# EAGLE design RH027.1 (EAGLE 7.1.0)
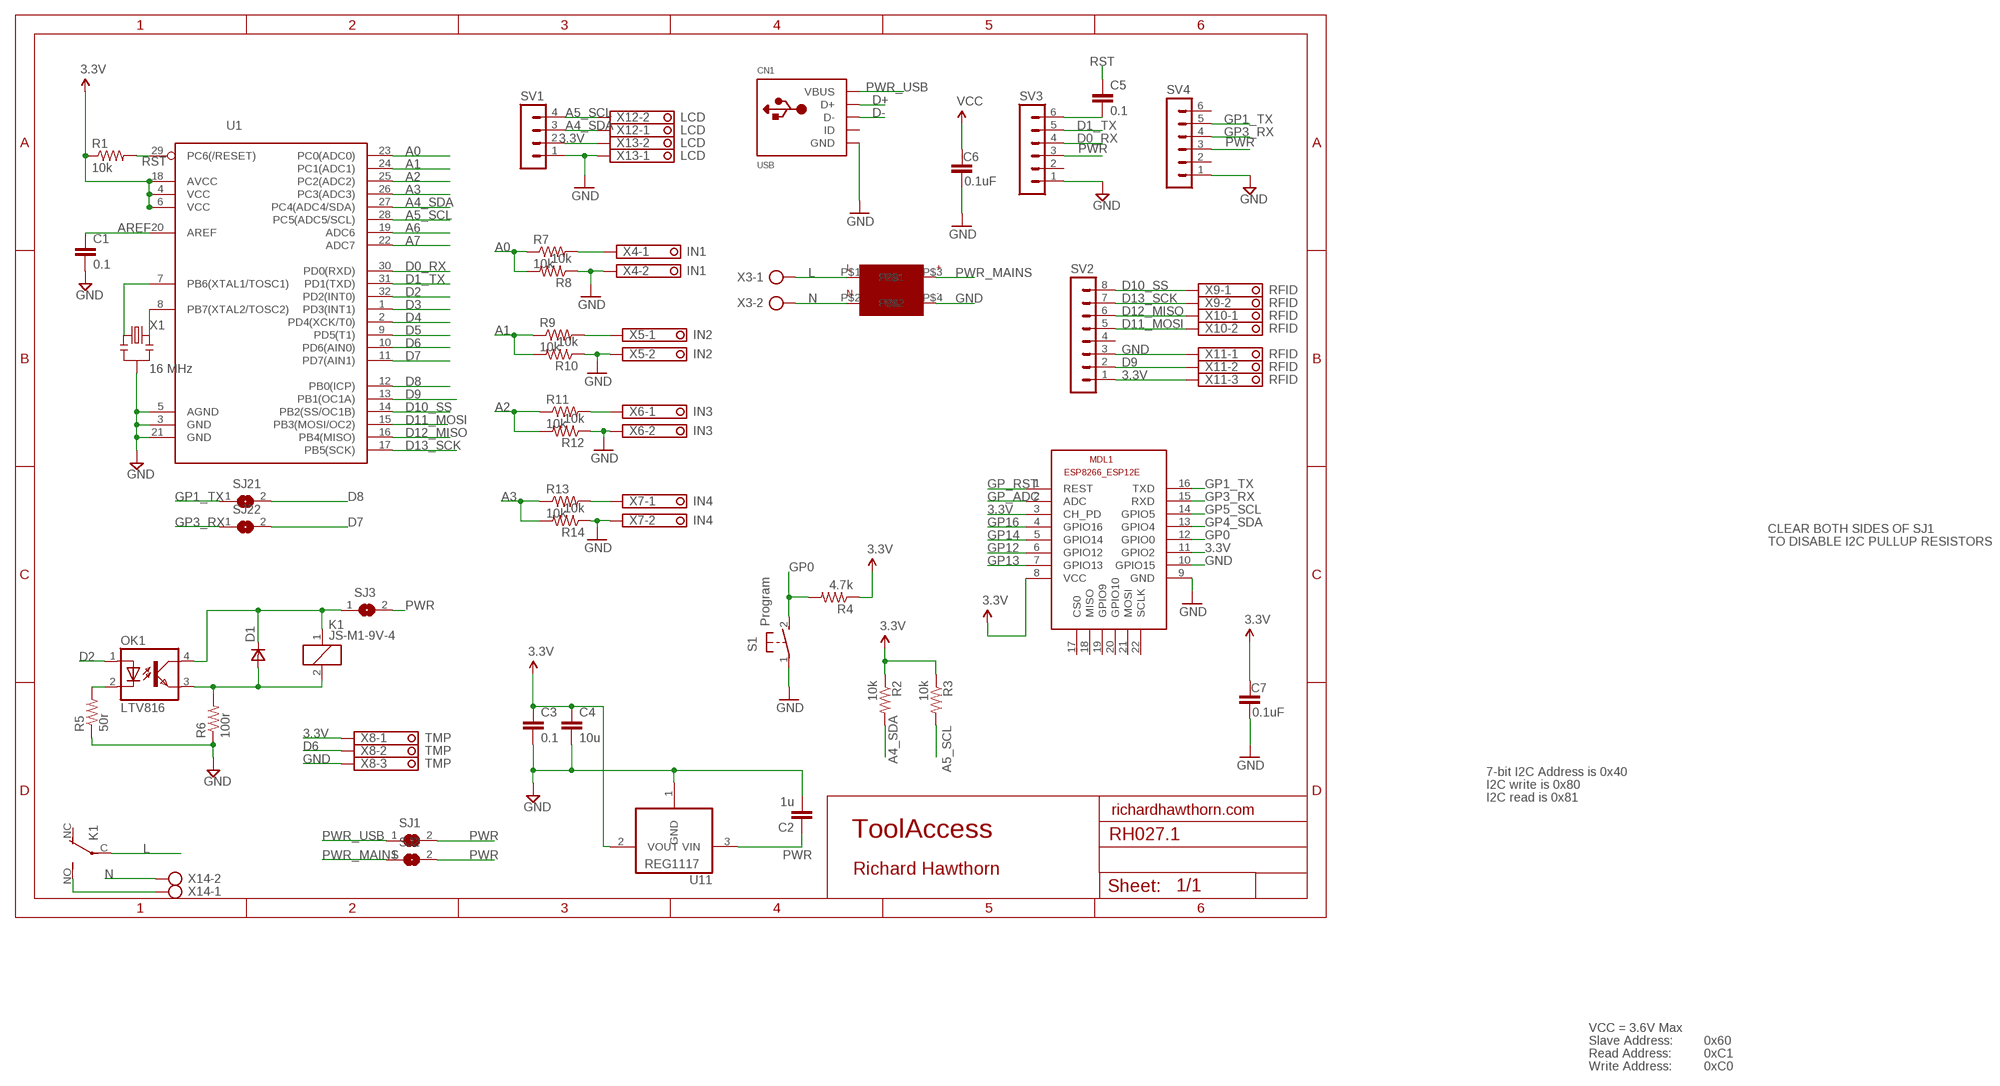
[diagram p0: schematic, sheet 1]

## Parts
C1  0.1  CAP0603-CAP  [0603-CAP]
C2  1u  CAP0603-CAP  [0603-CAP]
C3  0.1  CAP0603-CAP  [0603-CAP]
C4  10u  CAP0805-CAP  [0805-CAP]
C5  0.1  CAP0603-CAP  [0603-CAP]
C6  0.1uF  0.1UF-25V(+80/-20%)(0603)  [0603-CAP]
C7  0.1uF  0.1UF-25V(+80/-20%)(0603)  [0603-CAP]
CN1  USB  USBMINIB  [USB-MINIB]
D1  VAR2SOT23  [SOT-23]
K1  JS-M1-9V-4  [JS-M]
MDL1  ESP8266-12EESP8266-ESP12E  [ESP8266-ESP12E]
OK1  LTV816  [DIL04]
R1  10k  RESISTOR0603-RES  [0603-RES]
R2  10k  RESISTOR0805-RES  [0805]
R3  10k  RESISTOR0805-RES  [0805]
R4  4.7k  RESISTOR0805-RES  [0805]
R5  50r  RESISTOR0603-RES  [0603-RES]
R6  100r  RESISTOR0603-RES  [0603-RES]
R7  10k  RESISTOR0603-RES  [0603-RES]
R8  10k  RESISTOR0603-RES  [0603-RES]
R9  10k  RESISTOR0603-RES  [0603-RES]
R10  10k  RESISTOR0603-RES  [0603-RES]
R11  10k  RESISTOR0603-RES  [0603-RES]
R12  10k  RESISTOR0603-RES  [0603-RES]
R13  10k  RESISTOR0603-RES  [0603-RES]
R14  10k  RESISTOR0603-RES  [0603-RES]
S1  Program  DTSM-3  [DTSM-3]
SJ1  SJ  [SJ]
SJ2  SJ  [SJ]
SJ3  SJ  [SJ]
SJ21  SJ  [SJ]
SJ22  SJ  [SJ]
SV1  MA04-1  [MA04-1]
SV2  MA08-1  [MA08-1]
SV3  MA06-1  [MA06-1]
SV4  MA06-1  [MA06-1]
U1  ATMega-328  ATMEGA168/328TQFP32  [TQFP32-08]
U11  REG1117  [SOT223]
U$1  5VPWR  [5VPWR]
X1  16 MHz  RESONATORSMD  [RESONATOR-SMD]
X3  AK500/2  [AK500/2]
X4  IN1  1751248  [1751248]
X5  IN2  1751248  [1751248]
X6  IN3  1751248  [1751248]
X7  IN4  1751248  [1751248]
X8  TMP  1751251  [1751251]
X9  RFID  1751248  [1751248]
X10  RFID  1751248  [1751248]
X11  RFID  1751251  [1751251]
X12  LCD  1751248  [1751248]
X13  LCD  1751248  [1751248]
X14  AK500/2  [AK500/2]

## Nets
3.3V: C3.1 C4.1 C6.1 C7.1 MDL1.3(CH_PD) MDL1.8(VCC) MDL1.11(GPIO2) R1.1 R2.1 R3.1 R4.1 SV1.2 SV2.1 U1.4(VCC) U1.6(VCC) U1.18(AVCC) U11.2(VOUT) X8.1 X11.3 X13.2 ; supply symbol labelled VCC
A0: R7.1 R8.2 U1.23(PC0(ADC0))
A1: R9.1 R10.2 U1.24(PC1(ADC1))
A2: R11.1 R12.2 U1.25(PC2(ADC2))
A3: R13.1 R14.2 U1.26(PC3(ADC3))
A4_SDA: R2.2 SV1.3 U1.27(PC4(ADC4/SDA)) X12.1
A5_SCL: R3.2 SV1.4 U1.28(PC5(ADC5/SCL)) X12.2
A6: U1.19(ADC6)
A7: U1.22(ADC7)
AREF: C1.1 U1.20(AREF)
D0_RX: SV3.4 U1.30(PD0(RXD))
D1_TX: SV3.5 U1.31(PD1(TXD))
D2: OK1.1(A) U1.32(PD2(INT0))
D3: U1.1(PD3(INT1))
D4: U1.2(PD4(XCK/T0))
D5: U1.9(PD5(T1))
D6: U1.10(PD6(AIN0)) X8.2
D7: SJ22.2 U1.11(PD7(AIN1))
D8: SJ21.2 U1.12(PB0(ICP))
D9: SV2.2 U1.13(PB1(OC1A)) X11.2
D10_SS: SV2.8 U1.14(PB2(SS/OC1B)) X9.1
D11_MOSI: SV2.5 U1.15(PB3(MOSI/OC2)) X10.2
D12_MISO: SV2.6 U1.16(PB4(MISO)) X10.1
D13_SCK: SV2.7 U1.17(PB5(SCK)) X9.2
D+: CN1.D+
D-: CN1.D-
GND [power]: C1.2 C2.2 C3.2 C4.2 C6.2 C7.2 CN1.GND MDL1.9(GND) MDL1.10(GPIO15) R5.1 R6.1 R8.1 R10.1 R12.1 R14.1 S1.1 SV1.1 SV2.3 SV3.1 SV4.1 U1.3(GND) U1.5(AGND) U1.21(GND) U11.1(GND) U$1.P$4 X1.2 X4.2 X5.2 X6.2 X7.2 X8.3 X11.1 X13.1
GP0: MDL1.12(GPIO0) R4.2 S1.2
GP1_TX: MDL1.16(TXD) SJ21.1 SV4.5
GP3_RX: MDL1.15(RXD) SJ22.1 SV4.4
GP4_SDA: MDL1.13(GPIO4)
GP5_SCL: MDL1.14(GPIO5)
GP12: MDL1.6(GPIO12)
GP13: MDL1.7(GPIO13)
GP14: MDL1.5(GPIO14)
GP16: MDL1.4(GPIO16)
GP_ADC: MDL1.2(ADC)
GP_RST: MDL1.1(REST)
L [mains]: K1.C(2:P) U$1.P$1 X3.1
N [mains]: U$1.P$2 X3.2 X14.2
N$2: D1.3(A) K1.2 OK1.3(EMIT) R6.2
N$3: U1.7(PB6(XTAL1/TOSC1)) X1.1
N$4: OK1.2(C) R5.2
N$7 [mains]: K1.NO(2:S) X14.1
N$12: R9.2 X5.1
N$13: R7.2 X4.1
N$14: R11.2 X6.1
N$15: R13.2 X7.1
N$20: C5.2 SV3.6
N$21: U1.8(PB7(XTAL2/TOSC2)) X1.3
PWR [power]: C2.1 SJ1.2 SJ2.2 SJ3.2 SV3.3 SV4.3 U11.3(VIN)
PWR_MAINS: SJ2.1 U$1.P$3
PWR_USB [power]: CN1.VBUS SJ1.1
RL_PWR [power]: D1.1(C) K1.1 OK1.4(COL) SJ3.1
RST: C5.1 R1.2 U1.29(PC6(/RESET))
Unconnected: CN1.ID K1.NC(2:O) MDL1.17(CS0) MDL1.18(MISO) MDL1.19(GPIO9) MDL1.20(GPIO10) MDL1.21(MOSI) MDL1.22(SCLK) SV2.4 SV3.2 SV4.2 SV4.6

## Notes on the sheet
- CLEAR BOTH SIDES OF SJ1
- TO DISABLE I2C PULLUP RESISTORS
- 7-bit I2C Address is 0x40
- I2C write is 0x80
- I2C read is 0x81
- richardhawthorn.com
- ToolAccess
- Richard Hawthorn
- VCC = 3.6V Max
- Slave Address: | 0x60
- Read Address: | 0xC1
- Write Address: | 0xC0

## Library data of the parts
C1-C5 = LowPowerLab:CAP: Capacitor Standard 0603 ceramic capacitor, and 0.1" leaded capacitor.
C6 C7 = SparkFun-Capacitors:0.1UF-25V(+80/-20%)(0603): Ceramic Standard decoupling cap CAP-00810; PROD_ID: CAP-00810
CN1 = LowPowerLab:USB: USB Connectors USBMINIB - Surface Mount Female Mini-B USB Connector 4UConnector: 06564 By microbuilder.eu Thru-hole RA Female Mini-B USB Connector 4UConnector: 18732 By ladyada.net
D1 = zetex:VAR2SOT23: DIODE; OC_FARNELL: unknown; OC_NEWARK: unknown
K1 = relay:JS-M1*: Automotive Ultra-Miniature Power Relay NAiS Source: http://www.mew-europe.com/.. en_ds_61211_0000.pdf; OC_FARNELL: unknown; OC_NEWARK: unknown
MDL1 = ESP8266-ESP12E:ESP8266-12E: ESP8266-12E with additional I/O and GPIO04/05 corrected The author cannot warrant that this library is free from error or will meet your specific requirements. Created by PuceBaboon.com. Komagane, Nagano, JAPAN
OK1 = optocoupler:LTV816: OPTO COUPLER Source: LITEON, LTV816.pdf; OC_FARNELL: unknown; OC_NEWARK: unknown
R1 R5-R14 = LowPowerLab:RESISTOR: Resistor Basic schematic elements and footprints for 0603, 1206, and PTH resistors.
R2-R4 = SparkFun:RESISTOR: Resistor Basic schematic elements and footprints for 0603, 1206, and PTH resistors.
S1 = switch-tact:DTSM-3
SJ1-SJ3 SJ21 SJ22 = jumper:SJ: SMD solder JUMPER
SV1 = con-lstb:MA04-1: PIN HEADER; OC_FARNELL: unknown; OC_NEWARK: unknown
SV2 = con-lstb:MA08-1: PIN HEADER; OC_FARNELL: unknown; OC_NEWARK: unknown
SV3 SV4 = con-lstb:MA06-1: PIN HEADER; OC_FARNELL: unknown; OC_NEWARK: unknown
U1 = LowPowerLab:ATMEGA168/328: Atmel 32-pin 8-bit micro, 16k flash.
U11 = burr-brown:REG1117: 800mA and 1A Low Dropout (LDO) Positive Regulator 1.8V, 2.5V, 2.85V, 3.3V, 5V, and Adj; MPN: REG1117; OC_FARNELL: 1097566; OC_NEWARK: 14P6981
U$1 = Richards:5VPWR
X1 = SparkFun:RESONATOR: Resonator Small SMD resonator. This is the itty bitty 10/20MHz resonators with built in caps. CSTCE10M0G55 and CSTCE20M0V53. Footprint has been reviewed closely but hasn't been tested yet.
X3 X14 = con-ptr500:AK500/2: CONNECTOR; OC_FARNELL: unknown; OC_NEWARK: unknown
X4-X7 X9 X10 X12 X13 = con-phoenix-350:1751248: MKDS 1/ 2-3,5 Printklemme Nennstrom: 10 A Bemessungsspannung: 160 V Raster: 3,5 mm Polzahl: 2 Montageart: Löten Anschlussart: Schraubanschluss Anschlussrichtung vom Leiter zur Platine: 0° Source: http://eshop.phoenixcontact.com .. 1751248.pdf; OC_FARNELL: unknown; OC_NEWARK: unknown
X8 X11 = con-phoenix-350:1751251: MKDS 1/ 3-3,5 Printklemme Nennstrom: 10 A Bemessungsspannung: 160 V Raster: 3,5 mm Polzahl: 3 Montageart: Löten Anschlussart: Schraubanschluss Anschlussrichtung vom Leiter zur Platine: 0° Source: http://eshop.phoenixcontact.com .. 1751251.pdf; OC_FARNELL: unknown; OC_NEWARK: unknown

## Net classes
1 power: width 0.381 mm, clearance 0.254 mm
2 mains: width 3.048 mm

## Board
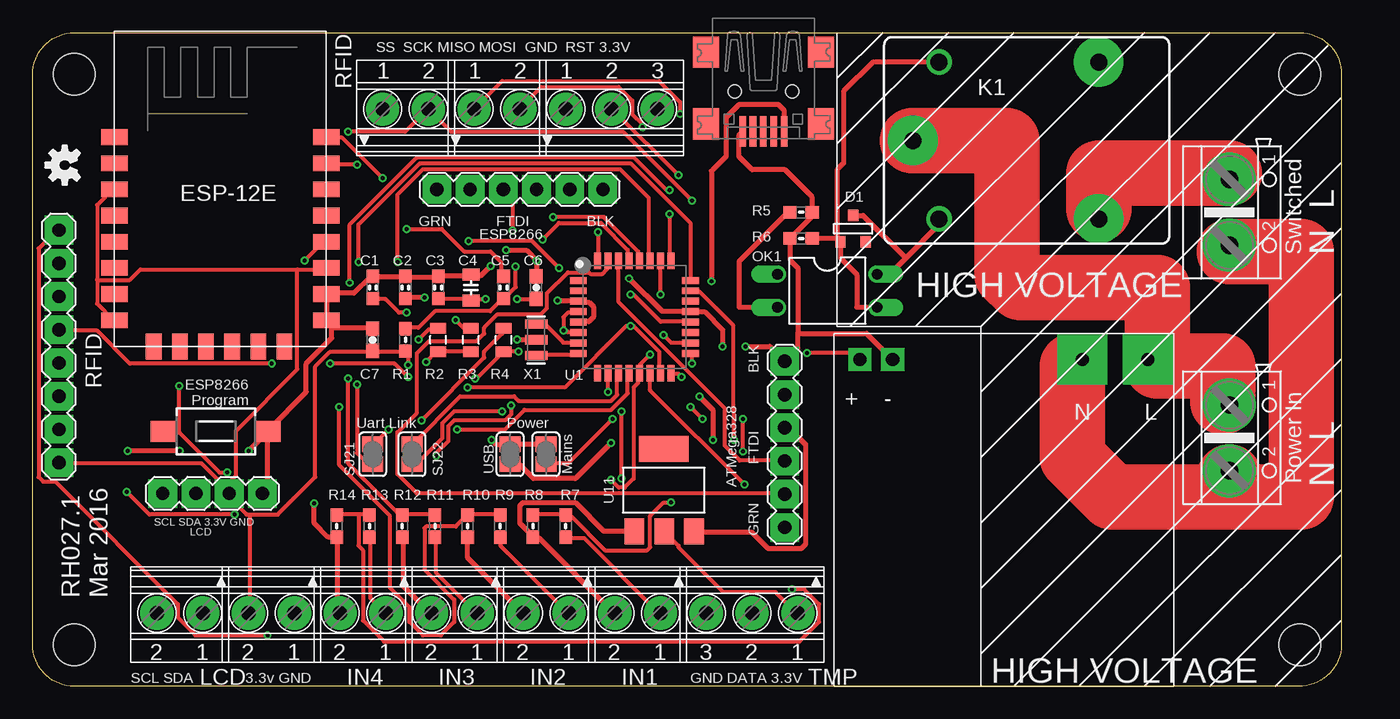
[diagram p1: board, top side]
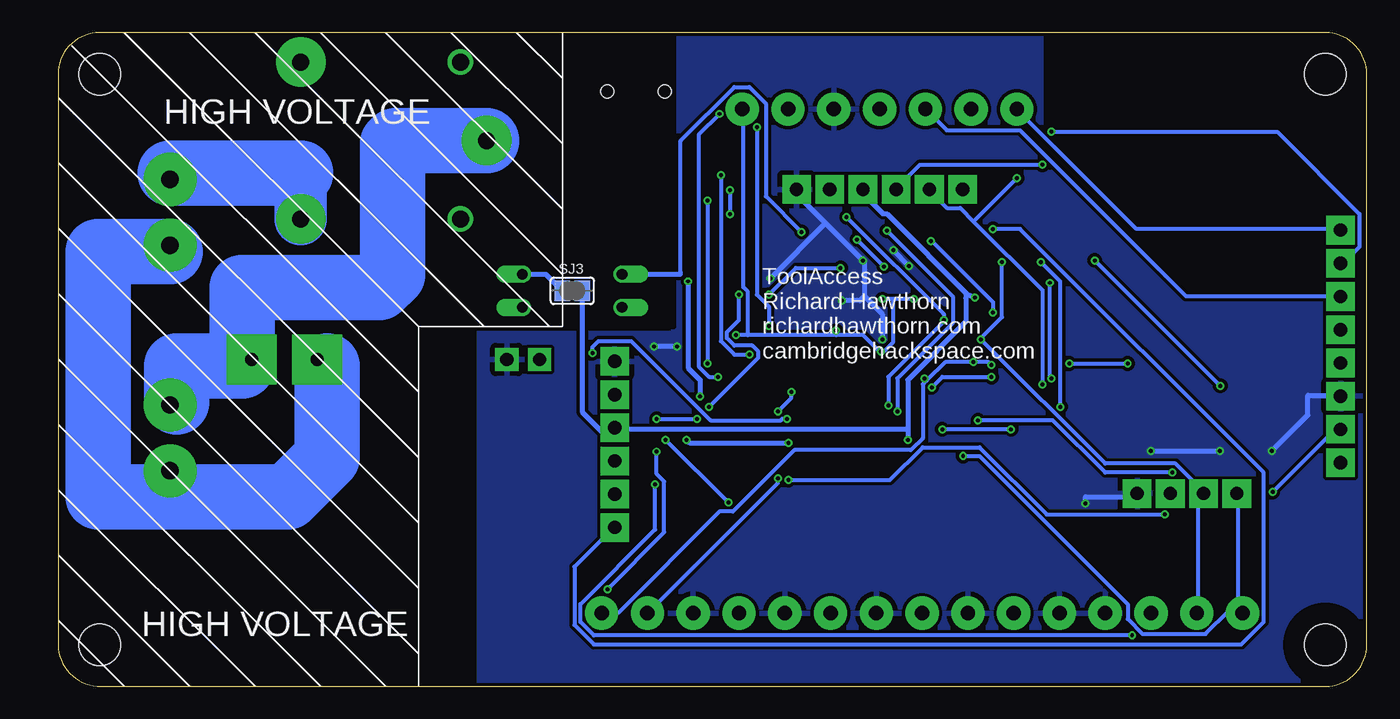
[diagram p2: board, bottom side, seen from below]

Size 100.06 x 49.99 mm. Coordinates in mm from the lower left corner, seen from the top.
Outline: 0,3.17 0,46.81 arc-90 3.17,49.99 96.89,49.99 arc-90 100.06,46.81 100.06,3.17 arc-90 96.76,0 3.17,0 arc-90 0,3.17
Copper layers (1*16): Top 0.035mm / dielectric 1.5mm / Bottom 0.035mm
Design rules "ITEADstudio_DRC *": minimum track width 12mil, minimum drill 12mil, track to track 6mil, track to pad 6mil, pad to pad 6mil, via to via 6mil, smd to smd 0mil, copper to edge 10mil, drill to drill 10mil, minimum pad ring 10mil, minimum via ring 6mil, stop-mask expansion 2mil, vias tented up to drill 100mil, thermal gap 15mil
Holes 3.2 mm at 3.17,3.17 96.89,3.17 3.17,46.81 96.89,46.81
tRestrict: area 0,43 to 24.5,49.8; area 93.9,43.8 to 99.9,49.8; area 93.9,0.2 to 99.9,6.2; area 0.2,0.2 to 6.2,6.2; 4 lines
bRestrict: area 0,43 to 24.5,49.8; area 0.2,0.2 to 6.2,6.2; area 93.9,43.8 to 99.9,49.8; area 93.9,0.2 to 99.9,6.2; 3 lines

### Footprints (pad centres in the part's own frame; a part is rotated, then mirrored left to right if it is on the bottom)
0603-CAP = smd 1.016 x 0.965: 1 -0.85,0; 2 0.85,0
0805-CAP = smd 0.902 x 1.3: 1 -1,0; 2 1,0
0603-CAP' = smd 1.1 x 1: 1 -0.85,0; 2 0.85,0
USB-MINIB = smd 0.5 x 2.308: D+ 0,4.064; D- -0.8,4.064; GND 1.6,4.064; ID 0.8,4.064; VBUS -1.6,4.064 | smd 2 x 2.4: GND1 -4.4,-2; GND2 -4.4,3.5; GND3 4.4,3.5; GND4 4.4,-2 | hole 1: -2.2,1; 2.2,1
SOT-23 = smd 0.787 x 0.889: 1 0.025,-1.016; 2 -0.94,1.016; 3 0.991,1.016
JS-M = drill 1.3: 1 6.7,6; 2 6.7,-6 | drill 1.3 pad 3.81: C 8.7,0; NC -5.5,-6; NO -5.5,6
ESP8266-ESP12E = smd 2 x 1.2: 1 0,16; 2 0,14; 3 0,12; 4 0,10; 5 0,8; 6 0,6; 7 0,4; 8 0,2; 9 16.2,2; 10 16.2,4; 11 16.2,6; 12 16.2,8; 13 16.2,10; 14 16.2,12; 15 16.2,14; 16 16.2,16 | smd 1.2 x 2: 17 11,0; 18 3,0; 19 5,0; 20 13,0; 21 7,0; 22 9,0
DIL04 = drill 0.813 offset: 1 -1.27,-3.81; 2 1.27,-3.81; 3 1.27,3.81; 4 -1.27,3.81
0603-RES = smd 1.016 x 0.965: 1 -0.85,0; 2 0.85,0
0805 = smd 0.8 x 1.2: 1 -0.9,0; 2 0.9,0
DTSM-3 = smd 2 x 1.6: 1 -3.97,0; 2 3.97,0
SJ = smd 1.168 x 1.6: 1 -0.762,0; 2 0.762,0
MA04-1 = drill 1.016 pad 2.184 square: 1 -3.81,0; 2 -1.27,0; 3 1.27,0; 4 3.81,0
MA08-1 = drill 1.016 pad 2.184 square: 1 -8.89,0; 2 -6.35,0; 3 -3.81,0; 4 -1.27,0; 5 1.27,0; 6 3.81,0; 7 6.35,0; 8 8.89,0
MA06-1 = drill 1.016 pad 2.184 square: 1 -6.35,0; 2 -3.81,0; 3 -1.27,0; 4 1.27,0; 5 3.81,0; 6 6.35,0
TQFP32-08 = smd 1.27 x 0.533: 1 -4.293,2.8; 2 -4.293,2; 3 -4.293,1.2; 4 -4.293,0.4; 5 -4.293,-0.4; 6 -4.293,-1.2; 7 -4.293,-2; 8 -4.293,-2.8; 17 4.293,-2.8; 18 4.293,-2; 19 4.293,-1.2; 20 4.293,-0.4; 21 4.293,0.4; 22 4.293,1.2; 23 4.293,2; 24 4.293,2.8 | smd 0.533 x 1.27: 9 -2.8,-4.293; 10 -2,-4.293; 11 -1.2,-4.293; 12 -0.4,-4.293; 13 0.4,-4.293; 14 1.2,-4.293; 15 2,-4.293; 16 2.8,-4.293; 25 2.8,4.293; 26 2,4.293; 27 1.2,4.293; 28 0.4,4.293; 29 -0.4,4.293; 30 -1.2,4.293; 31 -2,4.293; 32 -2.8,4.293
SOT223 = smd 1.499 x 2.007: 1 -2.261,-3.15; 2 0.025,-3.15; 3 2.311,-3.15 | smd 3.81 x 2.007: 4 0,3.15
5VPWR = drill 1 pad 3.81 square: P$1 2,2; P$2 7,2 | drill 1 pad 1.778 square: P$3 24,2; P$4 21.5,2
RESONATOR-SMD = smd 0.7 x 1.7: 1 -1.2,0; 2 0,0; 3 1.2,0
AK500/2 = drill 1.321 pad 4.064: 1 -2.515,0; 2 2.515,0
1751248 = drill 1.1 pad 2.54: 1 -1.75,-0.1; 2 1.75,-0.1
1751251 = drill 1.1 pad 2.54: 1 -3.5,-0.1; 2 0,-0.1; 3 3.5,-0.1

### Placement (x,y rotation side)
C1  26,30.5 90 top
C2  28.5,30.5 90 top
C3  31,30.5 90 top
C4  33.5,30.5 90 top
C5  36,30.5 90 top
C6  0.1uF  [0603-CAP']  38.5,30.5 90 top
C7  0.1uF  [0603-CAP']  26,26.5 90 top
CN1  55.87,46.5 180 top
D1  62.75,35 180 top
K1  76,41.75 180 top
MDL1  6.25,26 0 top
OK1  60.75,30.25 270 top
R1  28.5,26.5 90 top
R2  31,26.5 90 top
R3  33.5,26.5 90 top
R4  36,26.5 90 top
R5  58.75,36.25 180 top
R6  58.75,34.25 0 top
R7  40.75,12.25 270 top
R8  38.25,12.25 90 top
R9  35.75,12.25 270 top
R10  33.25,12.25 90 top
R11  30.75,12.25 270 top
R12  28.25,12.25 90 top
R13  25.75,12.25 270 top
R14  23.25,12.25 90 top
S1  14,19.5 180 top
SJ1  36.5,17.75 90 top
SJ2  39.25,17.75 90 top
SJ3  60.75,30.25 0 bottom
SJ21  26,17.75 90 top
SJ22  29,17.75 90 top
SV1  13.75,14.75 180 top
SV2  2,26 90 top
SV3  57.5,18.5 270 top
SV4  37.25,38 180 top
U1  46,28.25 0 top
U11  48.25,15 0 top
U$1  87.25,27 180 top
U$3  [OSHW-LOGO-S]  2.45,39.85 90 top
X1  38.5,26.5 270 top
X3  91.5,19 270 top
X4  46.25,5.5 180 top
X5  39.25,5.5 180 top
X6  32.25,5.5 180 top
X7  25.25,5.5 180 top
X8  55,5.5 180 top
X9  28.5,44.25 0 top
X10  35.5,44.25 0 top
X11  44.25,44.25 0 top
X12  11.25,5.5 180 top
X13  18.25,5.5 180 top
X14  91.5,36.25 270 top

### Tracks (layer width: path | path; a pad name or v marks a point on that pad's centre or on a via)
3.3V  (via drill 0.3)
  Top 0.305: 40.63,27.38 40.58,27.43 40.58,28.23 40.92,28.57 41.6,28.57 U1.4 | 40.63,27.38 40.92,27.09 41.6,27.09 U1.6 | C3.1 31.09,29.6 33.49,29.6 C4.1 33.6,29.6 v34.63,29.6 | v37.03,29.6 38.41,29.6 C6.1 | v37.15,25.6 R4.1 35.89,25.49 33.95,23.55 v33.83,23.55 | v48.23,26.86 48.81,26.29 50.29,26.29 U1.18 | v40.58,27.2 40.58,27.32 40.63,27.38 | 4.92,31.09 4.92,36.8 6.17,38.06 MDL1.3 | 4.92,31.09 4.92,29.26 6.17,28 MDL1.8 | 20.23,31.89 8.23,31.89 7.43,31.09 4.92,31.09 | 20.23,31.89 22.4,31.89 MDL1.11 | U11.2 48.35,11.77 49.38,10.74 49.38,10.63 52.81,7.2 56.81,7.2 58.41,5.6 X8.1 | R3.1 31.09,25.6 R2.1 30.86,25.6 v30.06,24.8 | 16.57,13.14 16.34,13.14 15.09,14.4 15.09,14.74 SV1.2 | 16.57,13.14 18.75,13.14 21.6,16 21.6,24.46 22.75,25.6 25.95,25.6 C7.1 26.06,25.6 28.46,25.6 R1.1 28.46,25.49 28.69,25.26 v28.69,24.57 | SV2.1 2.06,17.03 12.92,17.03 15.09,14.86 SV1.2 | 16.57,13.14 16.57,5.6 X13.2 | 20.23,31.89 20.23,24.23 15.54,19.55 15.54,16.12 14.74,15.32 SV1.2
  Bottom 0.305: v34.63,29.6 36.23,29.6 | 36.23,29.6 v37.03,29.6 | 36.23,29.6 36.23,26.29 36.92,25.6 v37.15,25.6 37.26,25.6 38.52,26.86 40.58,26.86 | 40.58,26.86 47.32,26.86 | 47.32,26.86 v48.23,26.86 | 40.58,26.86 v40.58,27.2 | 47.32,26.86 47.32,30.18 47.66,30.52 47.66,44.12 X11.3 | v28.69,24.57 28.92,24.8 v30.06,24.8 32.23,24.8 33.66,23.37 | 33.66,23.37 33.95,23.09 33.95,18.97 34.86,18.06 43.78,18.06 48.46,13.37 49.49,13.37 57.26,5.6 58.41,5.6 X8.1 | 33.66,23.37 v33.83,23.55
A0  (via drill 0.3)
  Top 0.305: R8.2 38.29,13.14 40.69,13.14 R7.1 40.8,13.03 41.15,13.03 43.78,10.4 46.98,10.4 47.21,10.63 47.21,13.03 48.23,14.06 v48.81,14.06 | v53.61,18.86 53.61,21.26 53.58,21.29 53.58,27.57 50.98,30.18 50.41,30.18 U1.23
  Bottom 0.305: v48.81,14.06 v53.61,18.86
A1  (via drill 0.3)
  Top 0.305: R9.1 35.66,13.14 33.26,13.14 R10.2 33.15,13.03 32.35,12.23 30.06,12.23 29.95,12.12 29.95,8.91 32.23,6.63 32.23,4.92 31.2,3.89 29.83,3.89 28.8,4.92 28.8,6.06 27.32,7.54 27.32,13.03 23.43,16.92 v23.43,21.37 | v24.92,32.46 24.92,35.32 29.6,40.01 45.72,40.01 50.29,35.43 50.29,31.09 U1.24
  Bottom 0.305: v24.92,32.46 23.43,30.98 v23.43,21.37
A2  (via drill 0.3)
  Top 0.305: R11.1 30.75,13.14 28.35,13.14 R12.2 28.12,13.03 24.12,17.03 v24.12,23.55 | v48.69,36.12 48.69,32.58 U1.25 | v48.69,37.95 48.46,37.95 45.95,40.46 29.38,40.46 24.23,35.32 v24.23,30.86
  Bottom 0.305: v48.69,37.95 v48.69,36.12 | v24.23,30.86 24.23,23.66 v24.12,23.55
A3  (via drill 0.3)
  Top 0.305: 24.92,13.14 25.72,13.14 R13.1 | 24.92,13.14 23.32,13.14 R14.2 | v48.01,29.95 48.01,32.46 U1.26 | v51.21,20.46 v50.29,21.37 | v54.29,17.95 v54.29,20.46 | v58.06,7.43 58.98,7.43 60.12,6.29 60.12,4.92 58.64,3.43 26.86,3.43 25.26,5.03 25.26,10.4 24.92,10.74 24.92,13.14
  Bottom 0.305: v48.01,29.95 48.01,28 48.92,27.09 48.92,26.63 48.35,26.06 46.98,26.06 46.52,25.6 46.52,25.15 v50.29,21.37 | v54.29,20.46 v51.21,20.46 | v54.29,17.95 54.29,16.23 53.72,15.66 53.72,11.77 v58.06,7.43
A4_SDA  (via drill 0.3)
  Top 0.305: v29.49,26.52 30.29,27.32 30.98,27.32 R2.2 | v27.89,32.46 27.89,37.6 29.83,39.55 44.92,39.55 47.09,37.38 47.09,32.58 U1.27
  Bottom 0.305: v27.89,32.46 27.89,28.23 29.49,26.63 v29.49,26.52 20,17.03 14.63,17.03 12.46,14.86 SV1.3 12.57,14.63 12.92,14.29 12.92,5.6 X12.1
A5_SCL  (via drill 0.3)
  Top 0.305: v32.35,28 32.92,27.43 33.49,27.43 R3.2 | v39.78,35.89 43.66,35.89 46.29,33.26 46.29,32.58 U1.28 | v30.86,17.6 30.86,17.83 31.77,18.75 31.77,19.89 32.23,20.34 36.12,20.34 36.58,20.8 v36.58,21.49
  Bottom 0.305: SV1.4 9.83,14.74 9.83,5.83 9.6,5.6 X12.2 9.94,5.83 10.52,5.83 12.34,4 17.14,4 18.29,5.14 18.29,6.29 29.6,17.6 v30.86,17.6 | v39.78,35.89 32.35,28.46 v32.35,28 32.35,27.89 36.58,23.66 v36.58,21.49
AREF  (via drill 0.3)
  Top 0.305: v28.57,28.57 28,28.57 26.98,29.6 26.06,29.6 C1.1 | v33.32,34.06 38.18,34.06 v40.23,32 | v45.72,29.95 45.95,29.95 48.01,27.89 50.29,27.89 U1.20
  Bottom 0.305: v28.57,28.57 28.57,29.38 33.26,34.06 v33.32,34.06 | v40.23,32 43.66,32 v45.72,29.95
D0_RX
  Top 0.305: U1.30 44.81,32.46 44.81,29.38 52.92,21.26 52.92,18.4 54.06,17.26 57.49,17.26 SV3.4
D1_TX
  Top 0.305: U1.31 43.89,32.46 43.89,31.89 43.55,31.55 42.63,31.55 42.52,31.66 40.92,31.66 39.32,30.06 39.32,28.92 38.86,28.46 35.55,28.46 34.52,27.43 34.52,26.98 33.95,26.4 30.29,26.4 29.38,25.49 29.38,20.92 27.89,19.43 27.89,16.23 29.38,14.74 57.49,14.74 SV3.5
D2  (via drill 0.3)
  Top 0.305: v43.2,34.75 43.2,32.58 U1.32
  Bottom 0.305: v43.2,34.75 45.95,37.49 45.95,44.58 47.21,45.83 48.35,45.83 52.46,41.72 52.46,31.66 52.52,31.52
  Bottom 0.4: OK1.1 52.52,31.52 52.5,31.5
D6  (via drill 0.3)
  Top 0.305: v44.01,22.52 44.01,23.89 U1.10 | v45.03,15.89 v45.03,21.03
  Bottom 0.305: v44.01,22.52 44.01,22.06 v45.03,21.03 | v45.03,15.89 45.03,15.54 54.98,5.6 X8.2
D7
  Top 0.305: U1.11 44.69,23.89 44.69,22.29 44.23,21.83 37.15,21.83 36.8,22.17 32.69,22.17 29.03,18.52 SJ22.2
D8  (via drill 0.3)
  Top 0.305: v32.46,19.66 36.12,19.66 37.6,21.14 44.23,21.14 45.49,22.4 45.49,23.89 U1.12 | v27.2,19.66 26.06,18.52 SJ21.2
  Bottom 0.305: v27.2,19.66 v32.46,19.66
D9  (via drill 0.3)
  Top 0.305: v47.21,25.38 46.41,24.57 46.41,24 U1.13 46.29,23.89 46.29,23.2 45.95,22.86 45.95,15.89 45.26,15.2 44.81,15.2 v44.23,15.77 | v49.38,39.09 44.35,44.12 X11.2 | v7.2,14.86 8.91,13.14 v15.43,13.14
  Bottom 0.305: v47.21,25.38 48.35,25.38 49.38,26.4 v49.38,39.09 | v7.2,14.86 2.52,19.55 2.06,19.55 SV2.2 | v15.43,13.14 24.46,13.14 29.6,18.29 33.95,18.29 36.46,15.77 v44.23,15.77
D10_SS  (via drill 0.3)
  Top 0.305: v54.41,15.43 47.21,22.63 47.21,23.89 U1.14 | v17.95,3.89 12.46,3.89 11.09,5.26 11.09,6.29 1.71,15.66 0.8,15.66 0.46,16 0.46,33.49 1.94,34.98 SV2.8
  Bottom 0.305: v54.41,15.43 54.41,12 60.12,6.29 60.12,4.92 59.09,3.89 v17.95,3.89 | X9.1 26.75,44.12 17.6,34.98 2.06,34.98 SV2.8
D11_MOSI  (via drill 0.3)
  Top 0.305: v46.63,42.75 46.63,42.98 45.83,43.78 45.83,44.81 44.81,45.83 38.86,45.83 37.26,44.23 X10.2 | U1.15 47.89,24 47.89,25.6 45.95,27.55 v45.72,27.55 45.38,27.55 40.69,22.86 v33.26,22.86 | v18.29,24.69 7.43,24.69 4.92,27.2 2.06,27.2 SV2.5 | v22.75,24.69 27.66,24.69 v28.69,23.66
  Bottom 0.305: v45.72,27.55 45.72,29.03 46.63,29.95 v46.63,42.75 | v22.75,24.69 v18.29,24.69 | v28.69,23.66 32.46,23.66 v33.26,22.86
D12_MISO  (via drill 0.3)
  Top 0.305: v49.61,23.66 49.38,23.89 48.81,23.89 U1.16 | v49.49,43.78 49.49,44.69 47.89,46.29 35.89,46.29 33.83,44.23 X10.1
  Bottom 0.305: v49.61,23.66 50.29,23.66 51.09,24.46 51.09,42.18 v49.49,43.78 | SV2.6 2.06,29.83 13.83,29.83 26.52,42.52 32.12,42.52 33.72,44.12 X10.1
D13_SCK  (via drill 0.3)
  Top 0.305: v50.41,24.69 50.41,25.38 U1.17 | v50.41,37.15 45.15,42.41 32,42.41 30.29,44.12 X9.2 30.18,44.12 28.46,42.41 v24.12,42.41
  Bottom 0.305: v50.41,37.15 v50.41,24.69 | v24.12,42.41 6.86,42.41 0.57,36.12 0.57,33.6 1.71,32.46 1.94,32.46 SV2.7
GND  (via drill 0.3)
  Top 0.381: 22.97,27.43 25.95,27.43 C7.2 | 22.97,27.43 22.52,27.89 MDL1.9 22.52,28.12 22.52,29.95 MDL1.10 22.63,30.06 24.57,30.06 25.83,31.32 C1.2 26.06,31.32 28.46,31.32 C2.2 28.57,31.32 30.98,31.32 C3.2 31.09,31.43 33.49,31.43 C4.2 | U1.5 41.72,27.89 42.52,27.89 42.86,28.23 42.86,29.03 42.52,29.38 41.72,29.38 U1.3 41.6,29.49 v40.12,29.49 | R14.1 23.32,11.32 23.32,5.71 23.43,5.6 X7.2 | R12.1 28.35,11.32 28.35,7.66 30.4,5.6 X6.2 | R10.1 33.26,11.32 33.26,9.83 X5.2 | X4.2 44.46,5.6 38.75,11.32 38.29,11.32 R8.1 38.18,11.54 37.26,12.46 37.26,13.83 37.49,14.06 41.49,14.06 43.66,11.89 45.95,11.89 U11.1 | v38.52,32.58 38.52,31.43 C6.2 | v45.61,31.2 48.12,28.69 50.29,28.69 U1.21 | v37.03,26.52 38.41,26.52 X1.2 | SV1.1 17.6,14.86 17.95,15.2 17.95,19.43 S1.1 18.06,19.66 20.92,22.52 20.92,24.69 22.86,26.63 22.86,27.32 22.97,27.43
  Top 0.4: CN1.GND 54,42.17 54,40.5 55,39.5 57.5,39.5 59.6,37.4 R5.1 59.6,35.95 R6.1 57.9,32.6 58.5,32 58.5,27 | R14.1 22.6,11.4 21.5,12.5 v21.5,14 | 58.5,27 58.5,25.85 SV3.1 56.35,26 v54.5,26 | 58.5,27 63.75,27 U$1.P$4 | U1.21 51.35,28.65 52.75,27.25 v52.75,26 | S1.1 17.97,19.47 v16.5,18 | v11.25,18 v7.25,18 | 33.49,31.43 34.28,31.43 v35,32.15 | v36.2,33.35 37.74,33.35 v38.52,32.58
  Bottom 0.381: 41.38,35.43 43.55,37.6 43.55,37.95 SV4.1 | 41.38,35.43 v38.52,32.58 38.41,32.46 38.41,29.83 | 41.38,35.43 v45.61,31.2 | v37.03,26.52 37.03,28.46 38.41,29.83 | v40.12,29.49 38.75,29.49 38.41,29.83
  Bottom 0.4: v21.5,14 21.5,14.5 17.81,14.5 SV1.1 | v52.75,26 v54.5,26 | v16.5,18 v11.25,18 | v7.25,18 4.5,20.75 4.5,22.25 2.06,22.25 SV2.3 | v35,32.15 v36.2,33.35
  pour Bottom: 0,49.75 0,0 68,0 68,27 53,27 53,49.75
GP0  (via drill 0.3)
  Top 0.305: v29.72,20.34 34.52,25.15 34.52,25.6 35.89,26.98 35.89,27.32 R4.2 | v14.86,16.34 14.29,16.34 11.2,19.43 | 11.2,19.43 10.06,19.43 S1.2 | v20.8,32.58 22.17,33.95 22.4,33.95 MDL1.12 | 11.2,19.43 v11.2,22.97
  Bottom 0.305: v29.72,20.34 24,20.34 20,16.34 v14.86,16.34 | v11.2,22.97 v20.8,32.58
GP1_TX  (via drill 0.3)
  Top 0.305: v24.8,23.09 24.8,17.83 25.6,17.03 25.95,17.03 SJ21.1 | v26.75,38.86 23.66,41.95 22.52,41.95 MDL1.16
  Bottom 0.305: v24.8,23.09 24.8,30.29 30.06,35.55 | 30.06,35.55 31.09,36.58 32.12,36.58 33.49,37.95 SV4.5 | 30.06,35.55 v26.75,38.86
GP3_RX  (via drill 0.3)
  Top 0.305: v35.89,21.03 32.23,21.03 31.32,20.12 31.32,18.97 29.38,17.03 29.03,17.03 SJ22.1 | v36.69,34.85 36.69,37.26 36.01,37.95 SV4.4 | v24.8,39.89 22.52,39.89 MDL1.15
  Bottom 0.305: v35.89,21.03 35.89,23.55 31.66,27.77 31.66,29.82 v36.69,34.85 | v24.8,39.89 34.18,39.89 36.01,38.06 SV4.4
L
  Bottom 3: 86,24.5 85.5,25 U$1.P$1 85.5,25.25 85.5,25.5 86,26 | 91,24.5 91.5,24 | 74.25,41.75 74.5,41.5
  Bottom 4: 91.5,24 X3.1
  Bottom 5: 86,24.5 91,24.5 | K1.C 74.25,41.75 | 74.5,41.5 74.5,31.5 75.5,30.5 86,30.5 86,26
N
  Bottom 3: X3.2 91.5,14.5 | 79.5,24.5 U$1.P$2 | X14.2 91.5,33.25
  Bottom 5: 79.5,24.5 79.5,17.5 82.5,14.5 91.5,14.5 97,14.5 97,33.25 91.5,33.25
N$1
  Top 5: 91.5,39.25 81.5,39.25 81.5,36.5
N$2
  Top 0.4: K1.2 64.25,47.75 62,45.5 62,40 61.5,39.5 61.5,34.24 | 61.5,34.24 D1.3 61.76,32.74 63,31.5 63,29 64.54,29 OK1.3 | 61.5,34.24 R6.2
N$3
  Top 0.305: U1.7 41.6,26.29 40.58,26.29 39.2,27.66 38.52,27.66 X1.1
N$4
  Top 0.4: R5.2 57.75,36.25 54,32.5 54,29 56.92,29 OK1.2
N$5
  Top 5: 67.25,41.75 74.5,41.75 74.5,31.5 75.5,30.5 86,30.5 86,24.5 91,24.5 91,21.75
N$6
  Top 5: 79.5,24.5 79.5,17.5 82.5,14.5 91.5,14.5 | 91.5,14.5 97,14.5 97,33.25 91.5,33.25 | 91.5,14.5 91.5,16
N$7
  Bottom 3: 91.5,39.25 X14.1
  Bottom 4: K1.NO 81.5,39.25
  Bottom 5: 81.5,39.25 91.5,39.25
N$9
  Bottom 5: 91,21.75 91,22.5
N$12
  Top 0.305: R9.2 35.78,11.32 35.78,10.74 40.92,5.6 X5.1
N$13
  Top 0.305: R7.2 40.8,11.32 42.18,11.32 47.89,5.6 X4.1
N$14
  Top 0.305: R11.2 30.86,11.32 30.86,8.69 33.95,5.6 X6.1
N$15
  Top 0.305: R13.2 25.83,11.32 25.83,6.74 26.98,5.6 X7.1
N$20  (via drill 0.3)
  Top 0.305: v28.57,34.98 31.27,34.98 33,33.25 35,33.25 35.82,32.43 35.82,31.43 35.89,31.43 C5.2
  Bottom 0.305: v28.57,34.98 26.52,34.98 7.89,16.34 7.89,4.92 9.6,3.2 59.09,3.2 60.58,4.69 60.58,9.14 57.61,12.12 SV3.6
N$21
  Top 0.305: U1.8 41.6,25.38 38.52,25.38 X1.3
PWR  (via drill 0.3)
  Top 0.381: U11.3 50.63,11.77 54.98,11.77 56.24,10.52 58.75,10.52 59.09,10.86 59.09,18.52 57.95,19.66 57.61,19.66 SV3.3 | SJ2.2 39.2,18.52 36.58,18.52 SJ1.2 36.35,18.52 35.43,18.52 v35.09,18.86 | v29.95,29.72 28.57,29.72 C2.1
  Bottom 0.381: 30.57,30.02 v29.95,29.72 | 30.57,30.02 36.55,36 36.7,36.15 37,36.15 38.25,37.4 38.25,37.45 38.37,37.57 38.52,37.72 38.52,37.95 SV4.3 | 35.09,19.66 35.09,23.43 30.63,27.89 30.63,29.6 30.57,30.02 | 35.09,19.66 v35.09,18.86 | 35.09,19.66 57.38,19.66 SV3.3
  Bottom 0.4: SJ3.2 59.99,20.99 58.5,19.5 57.77,19.5 SV3.3
PWR_MAINS  (via drill 0.3)
  Top 0.305: v44.35,20.46 40.92,17.03 39.32,17.03 SJ2.1 | v59.21,25.49 62.75,25.49 63.21,25.03 U$1.P$3
  Bottom 0.305: v44.35,20.46 44.69,20.46 44.81,20.34 50.18,20.34 56.24,26.4 58.75,26.4 59.21,25.95 v59.21,25.49
PWR_USB  (via drill 0.3)
  Top 0.381: v44.23,18.63 41.49,15.89 38.29,15.89 37.26,16.92 36.58,16.92 SJ1.1 | v52.01,18.86 52.01,21.14 v50.98,22.17 | v51.89,30.98 51.89,39.43 52,39.5
  Top 0.4: CN1.VBUS 57.47,44.03 57,44.5 54,44.5 53,43.5 53,40.5 52,39.5
  Bottom 0.381: v44.23,18.63 51.78,18.63 v52.01,18.86 | v50.98,22.17 50.98,23.43 51.89,24.35 v51.89,30.98
RL_PWR
  Top 0.4: K1.1 69.3,35.3 66.75,32.75 | 66.75,32.75 65.5,31.5 64.58,31.5 OK1.4 | D1.1 63.48,36.02 66.75,32.75
  Bottom 0.4: OK1.4 62.78,31.52 SJ3.1
RST  (via drill 0.3)
  Top 0.305: R1.2 28.57,27.43 29.49,27.43 30.75,28.69 34.98,28.69 35.89,29.6 C5.1 36.12,29.72 36.92,30.52 v36.92,32.12 | v38.98,34.18 40.23,35.43 43.43,35.43 45.49,33.38 45.49,32.58 U1.29
  Bottom 0.305: v36.92,32.12 v38.98,34.18

### Text on the board
tPlace: Switched | N L | HIGH VOLTAGE | Power In | N L | HIGH VOLTAGE
bPlace: HIGH VOLTAGE | HIGH VOLTAGE
tNames: SS SCK MISO MOSI GND RST 3.3V | GRN | FTDI | BLK | ESP8266 | RFID | ESP8266 | BLK | ATMega328 | Uart Link | Power | FTDI | USB | Mains | SCL SDA 3.3V GND | LCD | GRN | RH027.1 / Mar 2016 | SCL SDA | 3.3v GND | GND DATA 3.3V
bNames: ToolAccess / Richard Hawthorn / richardhawthorn.com / cambridgehackspace.com
tDocu: REG